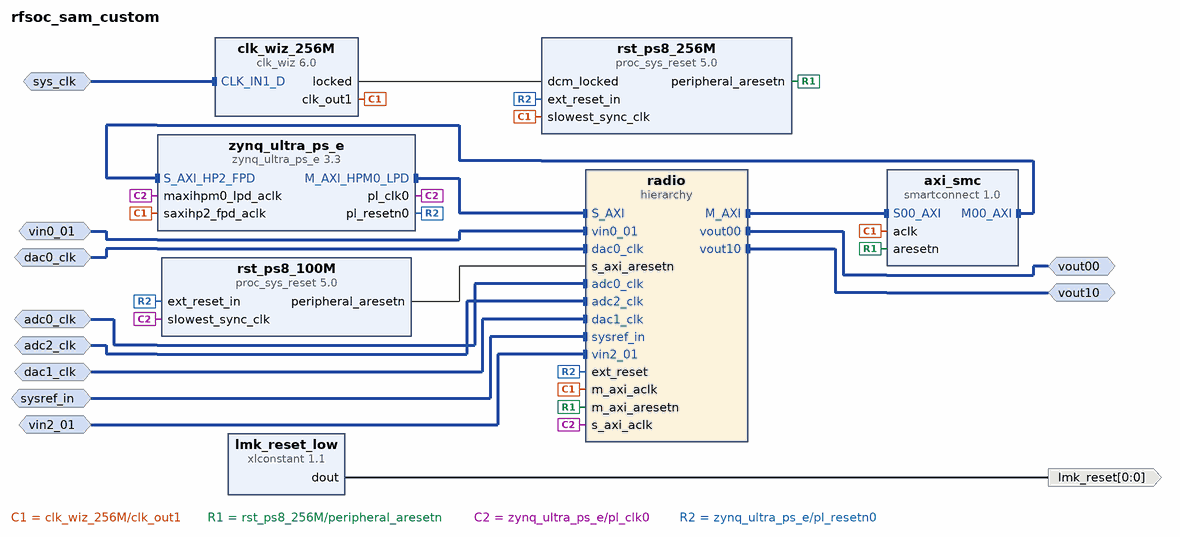
[diagram p0: block diagram of the top level]
# Vivado block design rfsoc_sam_custom, xczu28dr-ffvg1517-2-e, Vivado 2020.2
create_bd_design rfsoc_sam_custom

create_bd_intf_port -mode Slave -vlnv xilinx.com:interface:diff_clock_rtl:1.0 adc0_clk
set_property -dict {CONFIG.FREQ_HZ 409600000.0} [get_bd_intf_ports adc0_clk]
create_bd_intf_port -mode Slave -vlnv xilinx.com:interface:diff_clock_rtl:1.0 adc2_clk
set_property -dict {CONFIG.FREQ_HZ 409600000.0} [get_bd_intf_ports adc2_clk]
create_bd_intf_port -mode Slave -vlnv xilinx.com:interface:diff_clock_rtl:1.0 dac0_clk
set_property -dict {CONFIG.FREQ_HZ 256000000.0} [get_bd_intf_ports dac0_clk]
create_bd_intf_port -mode Slave -vlnv xilinx.com:interface:diff_clock_rtl:1.0 dac1_clk
set_property -dict {CONFIG.FREQ_HZ 409600000.0} [get_bd_intf_ports dac1_clk]
create_bd_intf_port -mode Slave -vlnv xilinx.com:interface:diff_clock_rtl:1.0 sys_clk
set_property -dict {CONFIG.FREQ_HZ 200000000} [get_bd_intf_ports sys_clk]
create_bd_intf_port -mode Slave -vlnv xilinx.com:display_usp_rf_data_converter:diff_pins_rtl:1.0 sysref_in
create_bd_intf_port -mode Slave -vlnv xilinx.com:interface:diff_analog_io_rtl:1.0 vin0_01
create_bd_intf_port -mode Slave -vlnv xilinx.com:interface:diff_analog_io_rtl:1.0 vin2_01
create_bd_intf_port -mode Master -vlnv xilinx.com:interface:diff_analog_io_rtl:1.0 vout00
create_bd_intf_port -mode Master -vlnv xilinx.com:interface:diff_analog_io_rtl:1.0 vout10
create_bd_port -dir O -from 0 -to 0 lmk_reset

create_bd_cell -type ip -vlnv xilinx.com:ip:smartconnect:1.0 axi_smc
set_property -dict {CONFIG.NUM_SI 1} [get_bd_cells axi_smc]
create_bd_cell -type ip -vlnv xilinx.com:ip:clk_wiz:6.0 clk_wiz_256M
set_property -dict [list \
  CONFIG.CLKIN1_JITTER_PS 50.0 \
  CONFIG.CLKOUT1_JITTER 133.468 \
  CONFIG.CLKOUT1_PHASE_ERROR 176.321 \
  CONFIG.CLKOUT1_REQUESTED_OUT_FREQ 256 \
  CONFIG.MMCM_CLKFBOUT_MULT_F 28.000 \
  CONFIG.MMCM_CLKIN1_PERIOD 5.000 \
  CONFIG.MMCM_CLKIN2_PERIOD 10.0 \
  CONFIG.MMCM_CLKOUT0_DIVIDE_F 4.375 \
  CONFIG.MMCM_DIVCLK_DIVIDE 5 \
  CONFIG.PRIM_IN_FREQ 200 \
  CONFIG.PRIM_SOURCE Differential_clock_capable_pin \
  CONFIG.RESET_PORT reset \
  CONFIG.RESET_TYPE ACTIVE_HIGH \
  CONFIG.USE_RESET false \
] [get_bd_cells clk_wiz_256M]
create_bd_cell -type ip -vlnv xilinx.com:ip:xlconstant:1.1 lmk_reset_low
set_property -dict {CONFIG.CONST_VAL 0} [get_bd_cells lmk_reset_low]
create_bd_cell -type hier radio
create_bd_cell -type ip -vlnv xilinx.com:ip:proc_sys_reset:5.0 rst_ps8_100M
create_bd_cell -type ip -vlnv xilinx.com:ip:proc_sys_reset:5.0 rst_ps8_256M
create_bd_cell -type ip -vlnv xilinx.com:ip:zynq_ultra_ps_e:3.3 zynq_ultra_ps_e
set_property -dict [list \
  CONFIG.CAN0_BOARD_INTERFACE custom \
  CONFIG.CAN1_BOARD_INTERFACE custom \
  CONFIG.CSU_BOARD_INTERFACE custom \
  CONFIG.DP_BOARD_INTERFACE custom \
  CONFIG.GEM0_BOARD_INTERFACE custom \
  CONFIG.GEM1_BOARD_INTERFACE custom \
  CONFIG.GEM2_BOARD_INTERFACE custom \
  CONFIG.GEM3_BOARD_INTERFACE custom \
  CONFIG.GPIO_BOARD_INTERFACE custom \
  CONFIG.IIC0_BOARD_INTERFACE custom \
  CONFIG.IIC1_BOARD_INTERFACE custom \
  CONFIG.NAND_BOARD_INTERFACE custom \
  CONFIG.PCIE_BOARD_INTERFACE custom \
  CONFIG.PJTAG_BOARD_INTERFACE custom \
  CONFIG.PMU_BOARD_INTERFACE custom \
  CONFIG.PSU_BANK_0_IO_STANDARD LVCMOS33 \
  CONFIG.PSU_BANK_1_IO_STANDARD LVCMOS33 \
  CONFIG.PSU_BANK_2_IO_STANDARD LVCMOS33 \
  CONFIG.PSU_BANK_3_IO_STANDARD LVCMOS33 \
  CONFIG.PSU_USB3__DUAL_CLOCK_ENABLE 0 \
  CONFIG.PSU__CAN1__PERIPHERAL__ENABLE 0 \
  CONFIG.PSU__CRF_APB__ACPU_CTRL__FREQMHZ 1333.333 \
  CONFIG.PSU__CRF_APB__ACPU_CTRL__SRCSEL APLL \
  CONFIG.PSU__CRF_APB__APLL_CTRL__SRCSEL PSS_REF_CLK \
  CONFIG.PSU__CRF_APB__DBG_FPD_CTRL__FREQMHZ 250 \
  CONFIG.PSU__CRF_APB__DBG_FPD_CTRL__SRCSEL IOPLL \
  CONFIG.PSU__CRF_APB__DBG_TRACE_CTRL__FREQMHZ 250 \
  CONFIG.PSU__CRF_APB__DBG_TRACE_CTRL__SRCSEL IOPLL \
  CONFIG.PSU__CRF_APB__DBG_TSTMP_CTRL__FREQMHZ 250 \
  CONFIG.PSU__CRF_APB__DBG_TSTMP_CTRL__SRCSEL IOPLL \
  CONFIG.PSU__CRF_APB__DDR_CTRL__FREQMHZ 800 \
  CONFIG.PSU__CRF_APB__DDR_CTRL__SRCSEL DPLL \
  CONFIG.PSU__CRF_APB__DPDMA_REF_CTRL__FREQMHZ 600 \
  CONFIG.PSU__CRF_APB__DPDMA_REF_CTRL__SRCSEL DPLL \
  CONFIG.PSU__CRF_APB__DPLL_CTRL__SRCSEL PSS_REF_CLK \
  CONFIG.PSU__CRF_APB__DP_AUDIO_REF_CTRL__SRCSEL VPLL \
  CONFIG.PSU__CRF_APB__DP_STC_REF_CTRL__SRCSEL VPLL \
  CONFIG.PSU__CRF_APB__DP_VIDEO_REF_CTRL__SRCSEL DPLL \
  CONFIG.PSU__CRF_APB__GDMA_REF_CTRL__FREQMHZ 600 \
  CONFIG.PSU__CRF_APB__GDMA_REF_CTRL__SRCSEL DPLL \
  CONFIG.PSU__CRF_APB__GPU_REF_CTRL__FREQMHZ 600 \
  CONFIG.PSU__CRF_APB__GPU_REF_CTRL__SRCSEL DPLL \
  CONFIG.PSU__CRF_APB__TOPSW_LSBUS_CTRL__FREQMHZ 100 \
  CONFIG.PSU__CRF_APB__TOPSW_LSBUS_CTRL__SRCSEL IOPLL \
  CONFIG.PSU__CRF_APB__TOPSW_MAIN_CTRL__FREQMHZ 533.333 \
  CONFIG.PSU__CRF_APB__TOPSW_MAIN_CTRL__SRCSEL VPLL \
  CONFIG.PSU__CRF_APB__VPLL_CTRL__SRCSEL PSS_REF_CLK \
  CONFIG.PSU__CRL_APB__ADMA_REF_CTRL__FREQMHZ 533.333 \
  CONFIG.PSU__CRL_APB__ADMA_REF_CTRL__SRCSEL RPLL \
  CONFIG.PSU__CRL_APB__CAN1_REF_CTRL__FREQMHZ 100 \
  CONFIG.PSU__CRL_APB__CAN1_REF_CTRL__SRCSEL IOPLL \
  CONFIG.PSU__CRL_APB__CPU_R5_CTRL__FREQMHZ 533.333 \
  CONFIG.PSU__CRL_APB__CPU_R5_CTRL__SRCSEL RPLL \
  CONFIG.PSU__CRL_APB__DBG_LPD_CTRL__FREQMHZ 250 \
  CONFIG.PSU__CRL_APB__DBG_LPD_CTRL__SRCSEL IOPLL \
  CONFIG.PSU__CRL_APB__GEM3_REF_CTRL__FREQMHZ 125 \
  CONFIG.PSU__CRL_APB__GEM3_REF_CTRL__SRCSEL IOPLL \
  CONFIG.PSU__CRL_APB__I2C0_REF_CTRL__FREQMHZ 100 \
  CONFIG.PSU__CRL_APB__I2C0_REF_CTRL__SRCSEL IOPLL \
  CONFIG.PSU__CRL_APB__I2C1_REF_CTRL__FREQMHZ 100 \
  CONFIG.PSU__CRL_APB__I2C1_REF_CTRL__SRCSEL IOPLL \
  CONFIG.PSU__CRL_APB__IOPLL_CTRL__SRCSEL PSS_REF_CLK \
  CONFIG.PSU__CRL_APB__IOU_SWITCH_CTRL__FREQMHZ 267 \
  CONFIG.PSU__CRL_APB__IOU_SWITCH_CTRL__SRCSEL RPLL \
  CONFIG.PSU__CRL_APB__LPD_LSBUS_CTRL__FREQMHZ 100 \
  CONFIG.PSU__CRL_APB__LPD_LSBUS_CTRL__SRCSEL IOPLL \
  CONFIG.PSU__CRL_APB__LPD_SWITCH_CTRL__FREQMHZ 533.333 \
  CONFIG.PSU__CRL_APB__LPD_SWITCH_CTRL__SRCSEL RPLL \
  CONFIG.PSU__CRL_APB__PCAP_CTRL__FREQMHZ 200 \
  CONFIG.PSU__CRL_APB__PCAP_CTRL__SRCSEL IOPLL \
  CONFIG.PSU__CRL_APB__PL0_REF_CTRL__FREQMHZ 100 \
  CONFIG.PSU__CRL_APB__PL0_REF_CTRL__SRCSEL IOPLL \
  CONFIG.PSU__CRL_APB__QSPI_REF_CTRL__FREQMHZ 300 \
  CONFIG.PSU__CRL_APB__QSPI_REF_CTRL__SRCSEL IOPLL \
  CONFIG.PSU__CRL_APB__RPLL_CTRL__SRCSEL PSS_REF_CLK \
  CONFIG.PSU__CRL_APB__SDIO1_REF_CTRL__FREQMHZ 200 \
  CONFIG.PSU__CRL_APB__SDIO1_REF_CTRL__SRCSEL RPLL \
  CONFIG.PSU__CRL_APB__TIMESTAMP_REF_CTRL__FREQMHZ 100 \
  CONFIG.PSU__CRL_APB__TIMESTAMP_REF_CTRL__SRCSEL PSS_REF_CLK \
  CONFIG.PSU__CRL_APB__UART0_REF_CTRL__FREQMHZ 100 \
  CONFIG.PSU__CRL_APB__UART0_REF_CTRL__SRCSEL IOPLL \
  CONFIG.PSU__CRL_APB__UART1_REF_CTRL__FREQMHZ 100 \
  CONFIG.PSU__CRL_APB__UART1_REF_CTRL__SRCSEL IOPLL \
  CONFIG.PSU__CRL_APB__USB0_BUS_REF_CTRL__FREQMHZ 250 \
  CONFIG.PSU__CRL_APB__USB0_BUS_REF_CTRL__SRCSEL IOPLL \
  CONFIG.PSU__CRL_APB__USB3_DUAL_REF_CTRL__FREQMHZ 20 \
  CONFIG.PSU__CRL_APB__USB3_DUAL_REF_CTRL__SRCSEL IOPLL \
  CONFIG.PSU__CRL_APB__USB3__ENABLE 0 \
  CONFIG.PSU__CSUPMU__PERIPHERAL__VALID 0 \
  CONFIG.PSU__DDRC__BUS_WIDTH {64 Bit} \
  CONFIG.PSU__DDRC__COMPONENTS Components \
  CONFIG.PSU__DDRC__DEVICE_CAPACITY {2048 MBits} \
  CONFIG.PSU__DDRC__DRAM_WIDTH {8 Bits} \
  CONFIG.PSU__DDRC__ECC Disabled \
  CONFIG.PSU__DDRC__MEMORY_TYPE {DDR 4} \
  CONFIG.PSU__DDRC__SPEED_BIN DDR4_1600J \
  CONFIG.PSU__DDR_HIGH_ADDRESS_GUI_ENABLE 0 \
  CONFIG.PSU__DDR__INTERFACE__FREQMHZ 400.000 \
  CONFIG.PSU__DEVICE_TYPE RFSOC \
  CONFIG.PSU__DISPLAYPORT__PERIPHERAL__ENABLE 0 \
  CONFIG.PSU__DLL__ISUSED 0 \
  CONFIG.PSU__ENET3__PERIPHERAL__ENABLE 0 \
  CONFIG.PSU__FPD_SLCR__WDT1__FREQMHZ 100 \
  CONFIG.PSU__FPGA_PL0_ENABLE 1 \
  CONFIG.PSU__GPIO0_MIO__PERIPHERAL__ENABLE 0 \
  CONFIG.PSU__GPIO1_MIO__PERIPHERAL__ENABLE 0 \
  CONFIG.PSU__GPU_PP0__POWER__ON 0 \
  CONFIG.PSU__GPU_PP1__POWER__ON 0 \
  CONFIG.PSU__I2C0__PERIPHERAL__ENABLE 0 \
  CONFIG.PSU__I2C1__PERIPHERAL__ENABLE 0 \
  CONFIG.PSU__IOU_SLCR__IOU_TTC_APB_CLK__TTC0_SEL APB \
  CONFIG.PSU__IOU_SLCR__IOU_TTC_APB_CLK__TTC1_SEL APB \
  CONFIG.PSU__IOU_SLCR__IOU_TTC_APB_CLK__TTC2_SEL APB \
  CONFIG.PSU__IOU_SLCR__IOU_TTC_APB_CLK__TTC3_SEL APB \
  CONFIG.PSU__IOU_SLCR__TTC0__FREQMHZ 100 \
  CONFIG.PSU__IOU_SLCR__TTC1__FREQMHZ 100 \
  CONFIG.PSU__IOU_SLCR__TTC2__FREQMHZ 100 \
  CONFIG.PSU__IOU_SLCR__TTC3__FREQMHZ 100 \
  CONFIG.PSU__IOU_SLCR__WDT0__FREQMHZ 100 \
  CONFIG.PSU__LPD_SLCR__CSUPMU__FREQMHZ 100 \
  CONFIG.PSU__OVERRIDE_HPX_QOS 0 \
  CONFIG.PSU__OVERRIDE__BASIC_CLOCK 0 \
  CONFIG.PSU__PMU__PERIPHERAL__ENABLE 0 \
  CONFIG.PSU__PRESET_APPLIED 0 \
  CONFIG.PSU__PSS_REF_CLK__FREQMHZ 33.333 \
  CONFIG.PSU__QSPI__PERIPHERAL__ENABLE 0 \
  CONFIG.PSU__SATA__PERIPHERAL__ENABLE 0 \
  CONFIG.PSU__SD1__PERIPHERAL__ENABLE 0 \
  CONFIG.PSU__SWDT0__PERIPHERAL__ENABLE 0 \
  CONFIG.PSU__SWDT1__PERIPHERAL__ENABLE 0 \
  CONFIG.PSU__TTC0__PERIPHERAL__ENABLE 0 \
  CONFIG.PSU__TTC1__PERIPHERAL__ENABLE 0 \
  CONFIG.PSU__TTC2__PERIPHERAL__ENABLE 0 \
  CONFIG.PSU__TTC3__PERIPHERAL__ENABLE 0 \
  CONFIG.PSU__UART0__PERIPHERAL__ENABLE 0 \
  CONFIG.PSU__UART1__PERIPHERAL__ENABLE 0 \
  CONFIG.PSU__USB0__PERIPHERAL__ENABLE 0 \
  CONFIG.PSU__USE__IRQ0 0 \
  CONFIG.PSU__USE__M_AXI_GP0 0 \
  CONFIG.PSU__USE__M_AXI_GP1 0 \
  CONFIG.PSU__USE__M_AXI_GP2 1 \
  CONFIG.PSU__USE__S_AXI_GP4 1 \
  CONFIG.QSPI_BOARD_INTERFACE custom \
  CONFIG.SATA_BOARD_INTERFACE custom \
  CONFIG.SD0_BOARD_INTERFACE custom \
  CONFIG.SD1_BOARD_INTERFACE custom \
  CONFIG.SPI0_BOARD_INTERFACE custom \
  CONFIG.SPI1_BOARD_INTERFACE custom \
  CONFIG.SUBPRESET1 Custom \
  CONFIG.SUBPRESET2 Custom \
  CONFIG.SWDT0_BOARD_INTERFACE custom \
  CONFIG.SWDT1_BOARD_INTERFACE custom \
  CONFIG.TRACE_BOARD_INTERFACE custom \
  CONFIG.TTC0_BOARD_INTERFACE custom \
  CONFIG.TTC1_BOARD_INTERFACE custom \
  CONFIG.TTC2_BOARD_INTERFACE custom \
  CONFIG.TTC3_BOARD_INTERFACE custom \
  CONFIG.UART0_BOARD_INTERFACE custom \
  CONFIG.UART1_BOARD_INTERFACE custom \
  CONFIG.USB0_BOARD_INTERFACE custom \
  CONFIG.USB1_BOARD_INTERFACE custom \
] [get_bd_cells zynq_ultra_ps_e]
# 747 more settings of zynq_ultra_ps_e are not shown: defaults, MIO pin electricals, DDR timing, and values the tool derives

# ---- hierarchy /radio ----
current_bd_instance /radio
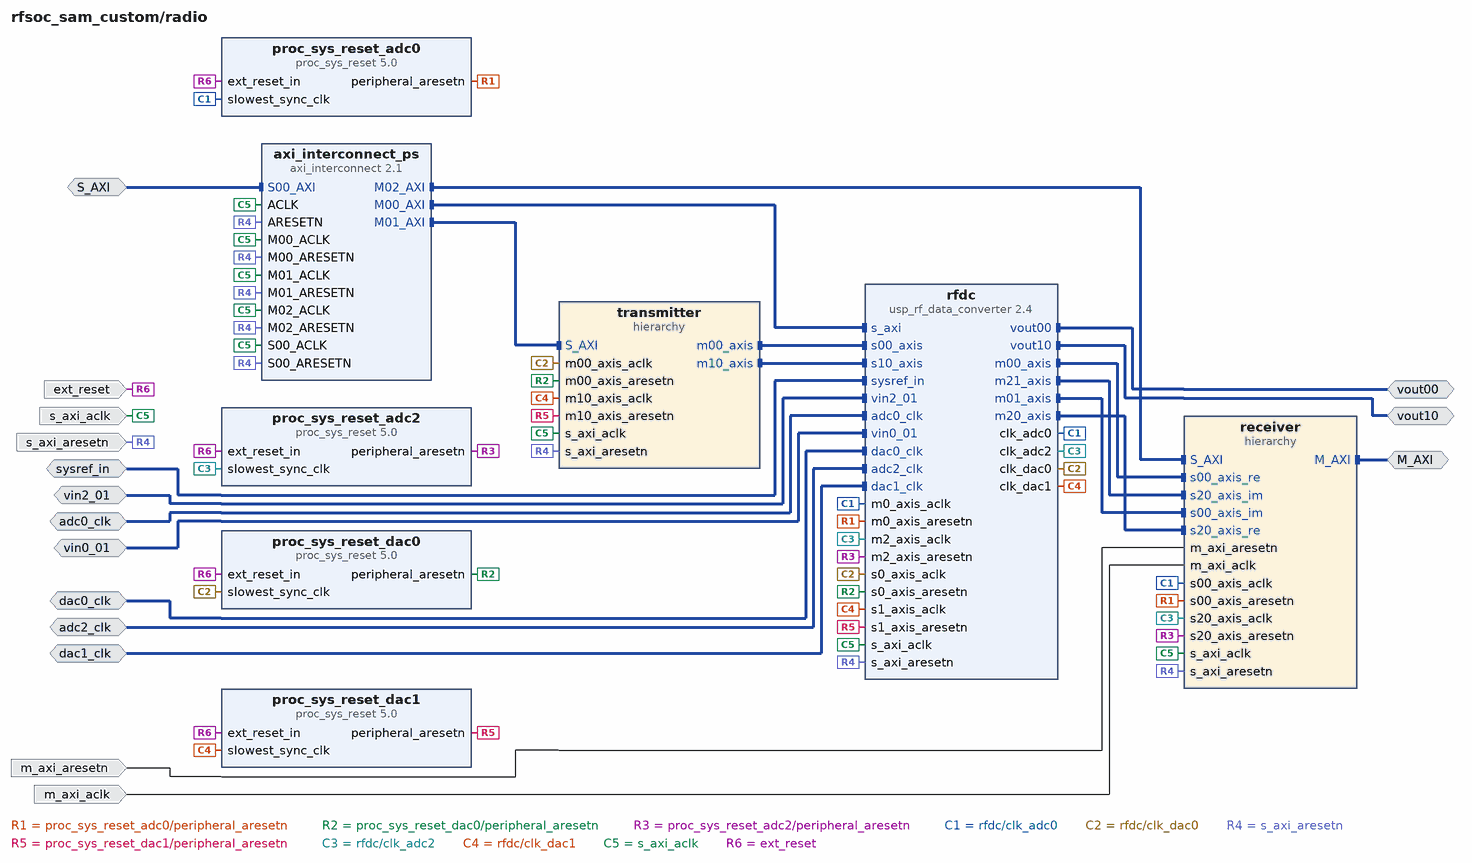
[diagram p1: block diagram inside /radio]
create_bd_intf_pin -mode Master -vlnv xilinx.com:interface:aximm_rtl:1.0 M_AXI
create_bd_intf_pin -mode Slave -vlnv xilinx.com:interface:aximm_rtl:1.0 S_AXI
create_bd_intf_pin -mode Slave -vlnv xilinx.com:interface:diff_clock_rtl:1.0 adc0_clk
create_bd_intf_pin -mode Slave -vlnv xilinx.com:interface:diff_clock_rtl:1.0 adc2_clk
create_bd_intf_pin -mode Slave -vlnv xilinx.com:interface:diff_clock_rtl:1.0 dac0_clk
create_bd_intf_pin -mode Slave -vlnv xilinx.com:interface:diff_clock_rtl:1.0 dac1_clk
create_bd_intf_pin -mode Slave -vlnv xilinx.com:display_usp_rf_data_converter:diff_pins_rtl:1.0 sysref_in
create_bd_intf_pin -mode Slave -vlnv xilinx.com:interface:diff_analog_io_rtl:1.0 vin0_01
create_bd_intf_pin -mode Slave -vlnv xilinx.com:interface:diff_analog_io_rtl:1.0 vin2_01
create_bd_intf_pin -mode Master -vlnv xilinx.com:interface:diff_analog_io_rtl:1.0 vout00
create_bd_intf_pin -mode Master -vlnv xilinx.com:interface:diff_analog_io_rtl:1.0 vout10
create_bd_pin -dir I -type rst ext_reset
create_bd_pin -dir I -type clk m_axi_aclk
create_bd_pin -dir I -type rst m_axi_aresetn
create_bd_pin -dir I -type clk s_axi_aclk
create_bd_pin -dir I -type rst s_axi_aresetn

create_bd_cell -type ip -vlnv xilinx.com:ip:axi_interconnect:2.1 axi_interconnect_ps
set_property -dict {CONFIG.NUM_MI 3} [get_bd_cells axi_interconnect_ps]
create_bd_cell -type ip -vlnv xilinx.com:ip:proc_sys_reset:5.0 proc_sys_reset_adc0
create_bd_cell -type ip -vlnv xilinx.com:ip:proc_sys_reset:5.0 proc_sys_reset_adc2
create_bd_cell -type ip -vlnv xilinx.com:ip:proc_sys_reset:5.0 proc_sys_reset_dac0
create_bd_cell -type ip -vlnv xilinx.com:ip:proc_sys_reset:5.0 proc_sys_reset_dac1
create_bd_cell -type hier receiver
create_bd_cell -type ip -vlnv xilinx.com:ip:usp_rf_data_converter:2.4 rfdc
set_property -dict [list \
  CONFIG.ADC0_Outclk_Freq 256.000 \
  CONFIG.ADC0_PLL_Enable true \
  CONFIG.ADC0_Refclk_Freq 409.600 \
  CONFIG.ADC0_Sampling_Rate 4.096 \
  CONFIG.ADC2_Outclk_Freq 256.000 \
  CONFIG.ADC2_PLL_Enable true \
  CONFIG.ADC2_Refclk_Freq 409.600 \
  CONFIG.ADC2_Sampling_Rate 4.096 \
  CONFIG.ADC_Data_Type00 1 \
  CONFIG.ADC_Data_Type20 1 \
  CONFIG.ADC_Data_Width00 8 \
  CONFIG.ADC_Decimation_Mode00 2 \
  CONFIG.ADC_Decimation_Mode20 2 \
  CONFIG.ADC_Mixer_Mode00 0 \
  CONFIG.ADC_Mixer_Mode20 0 \
  CONFIG.ADC_Mixer_Type00 2 \
  CONFIG.ADC_Mixer_Type01 2 \
  CONFIG.ADC_Mixer_Type20 2 \
  CONFIG.ADC_Mixer_Type21 2 \
  CONFIG.ADC_Slice00_Enable true \
  CONFIG.ADC_Slice20_Enable true \
  CONFIG.DAC0_Outclk_Freq 256.000 \
  CONFIG.DAC0_PLL_Enable true \
  CONFIG.DAC0_Refclk_Freq 256.000 \
  CONFIG.DAC0_Sampling_Rate 4.096 \
  CONFIG.DAC1_Outclk_Freq 256.000 \
  CONFIG.DAC1_PLL_Enable true \
  CONFIG.DAC1_Refclk_Freq 409.600 \
  CONFIG.DAC1_Sampling_Rate 4.096 \
  CONFIG.DAC_Data_Type10 0 \
  CONFIG.DAC_Data_Width10 16 \
  CONFIG.DAC_Interpolation_Mode00 2 \
  CONFIG.DAC_Interpolation_Mode10 2 \
  CONFIG.DAC_Mixer_Mode00 0 \
  CONFIG.DAC_Mixer_Mode10 0 \
  CONFIG.DAC_Mixer_Type00 2 \
  CONFIG.DAC_Mixer_Type10 2 \
  CONFIG.DAC_Slice00_Enable true \
  CONFIG.DAC_Slice10_Enable true \
] [get_bd_cells rfdc]
create_bd_cell -type hier transmitter

# ---- hierarchy /radio/receiver ----
current_bd_instance /radio/receiver
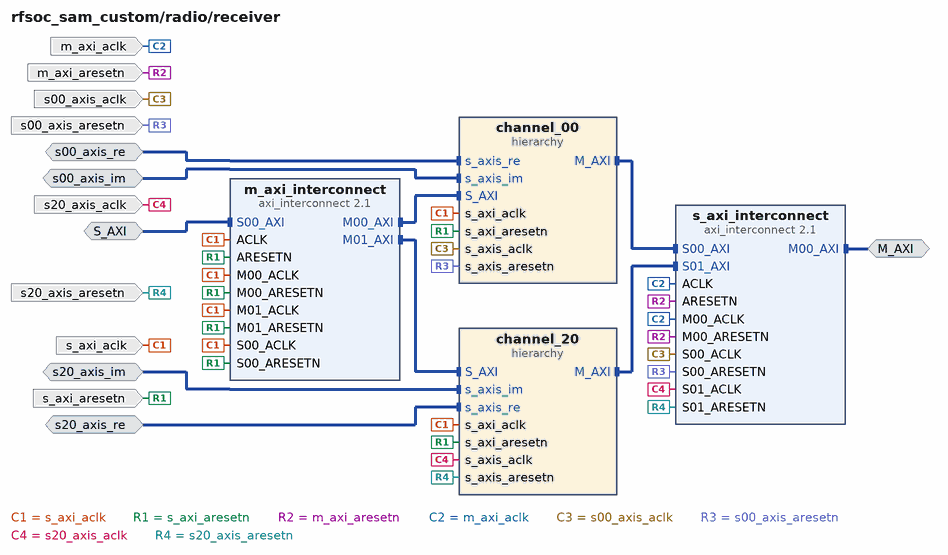
[diagram p2: block diagram inside /radio/receiver]
create_bd_intf_pin -mode Master -vlnv xilinx.com:interface:aximm_rtl:1.0 M_AXI
create_bd_intf_pin -mode Slave -vlnv xilinx.com:interface:aximm_rtl:1.0 S_AXI
create_bd_intf_pin -mode Slave -vlnv xilinx.com:interface:axis_rtl:1.0 s00_axis_im
create_bd_intf_pin -mode Slave -vlnv xilinx.com:interface:axis_rtl:1.0 s00_axis_re
create_bd_intf_pin -mode Slave -vlnv xilinx.com:interface:axis_rtl:1.0 s20_axis_im
create_bd_intf_pin -mode Slave -vlnv xilinx.com:interface:axis_rtl:1.0 s20_axis_re
create_bd_pin -dir I -type clk m_axi_aclk
create_bd_pin -dir I -type rst m_axi_aresetn
create_bd_pin -dir I -type clk s00_axis_aclk
create_bd_pin -dir I -type rst s00_axis_aresetn
create_bd_pin -dir I -type clk s20_axis_aclk
create_bd_pin -dir I -type rst s20_axis_aresetn
create_bd_pin -dir I -type clk s_axi_aclk
create_bd_pin -dir I -type rst s_axi_aresetn

create_bd_cell -type hier channel_00
create_bd_cell -type hier channel_20
create_bd_cell -type ip -vlnv xilinx.com:ip:axi_interconnect:2.1 m_axi_interconnect
create_bd_cell -type ip -vlnv xilinx.com:ip:axi_interconnect:2.1 s_axi_interconnect
set_property -dict [list \
  CONFIG.M00_HAS_DATA_FIFO 2 \
  CONFIG.NUM_MI 1 \
  CONFIG.NUM_SI 2 \
  CONFIG.S00_HAS_DATA_FIFO 2 \
  CONFIG.S01_HAS_DATA_FIFO 2 \
  CONFIG.STRATEGY 2 \
] [get_bd_cells s_axi_interconnect]

# ---- hierarchy /radio/receiver/channel_00 ----
current_bd_instance /radio/receiver/channel_00
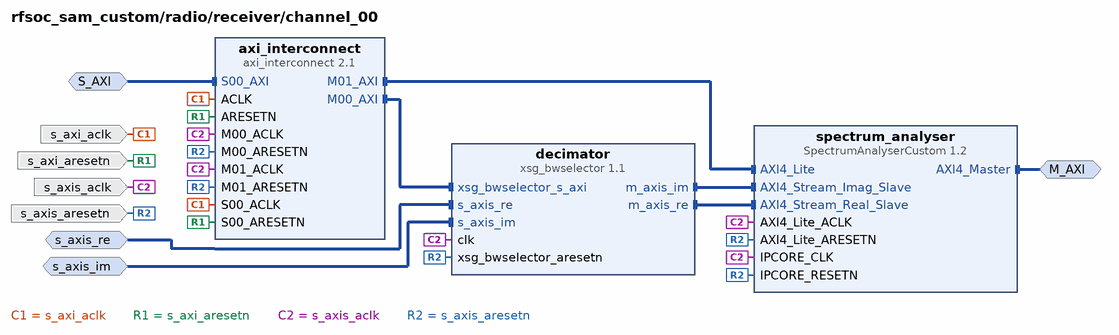
[diagram p3: block diagram inside /radio/receiver/channel_00]
create_bd_intf_pin -mode Master -vlnv xilinx.com:interface:aximm_rtl:1.0 M_AXI
create_bd_intf_pin -mode Slave -vlnv xilinx.com:interface:aximm_rtl:1.0 S_AXI
create_bd_intf_pin -mode Slave -vlnv xilinx.com:interface:axis_rtl:1.0 s_axis_im
create_bd_intf_pin -mode Slave -vlnv xilinx.com:interface:axis_rtl:1.0 s_axis_re
create_bd_pin -dir I -type clk s_axi_aclk
create_bd_pin -dir I -type rst s_axi_aresetn
create_bd_pin -dir I -type clk s_axis_aclk
create_bd_pin -dir I -type rst s_axis_aresetn

create_bd_cell -type ip -vlnv xilinx.com:ip:axi_interconnect:2.1 axi_interconnect
set_property -dict {CONFIG.NUM_MI 2} [get_bd_cells axi_interconnect]
create_bd_cell -type ip -vlnv strath.ac.uk:RFSoC:xsg_bwselector:1.1 decimator
create_bd_cell -type ip -vlnv xilinx.com:ip:SpectrumAnalyserCustom:1.2 spectrum_analyser

# ---- hierarchy /radio/receiver/channel_20 ----
current_bd_instance /radio/receiver/channel_20
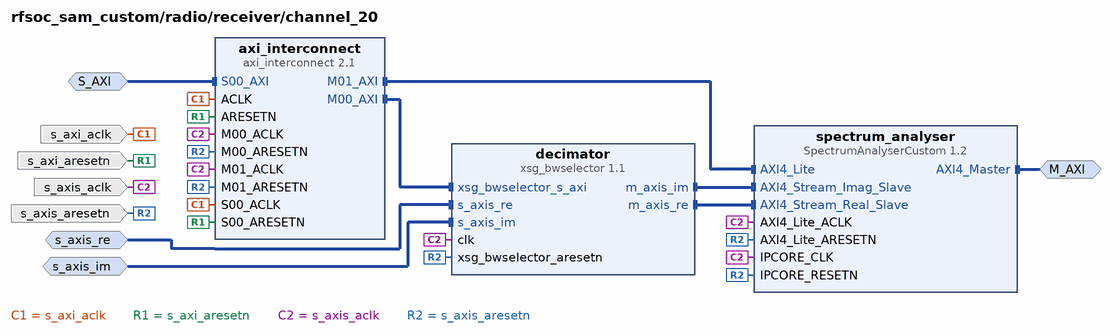
[diagram p4: block diagram inside /radio/receiver/channel_20]
create_bd_intf_pin -mode Master -vlnv xilinx.com:interface:aximm_rtl:1.0 M_AXI
create_bd_intf_pin -mode Slave -vlnv xilinx.com:interface:aximm_rtl:1.0 S_AXI
create_bd_intf_pin -mode Slave -vlnv xilinx.com:interface:axis_rtl:1.0 s_axis_im
create_bd_intf_pin -mode Slave -vlnv xilinx.com:interface:axis_rtl:1.0 s_axis_re
create_bd_pin -dir I -type clk s_axi_aclk
create_bd_pin -dir I -type rst s_axi_aresetn
create_bd_pin -dir I -type clk s_axis_aclk
create_bd_pin -dir I -type rst s_axis_aresetn

create_bd_cell -type ip -vlnv xilinx.com:ip:axi_interconnect:2.1 axi_interconnect
set_property -dict {CONFIG.NUM_MI 2} [get_bd_cells axi_interconnect]
create_bd_cell -type ip -vlnv strath.ac.uk:RFSoC:xsg_bwselector:1.1 decimator
create_bd_cell -type ip -vlnv xilinx.com:ip:SpectrumAnalyserCustom:1.2 spectrum_analyser

# ---- hierarchy /radio/transmitter ----
current_bd_instance /radio/transmitter
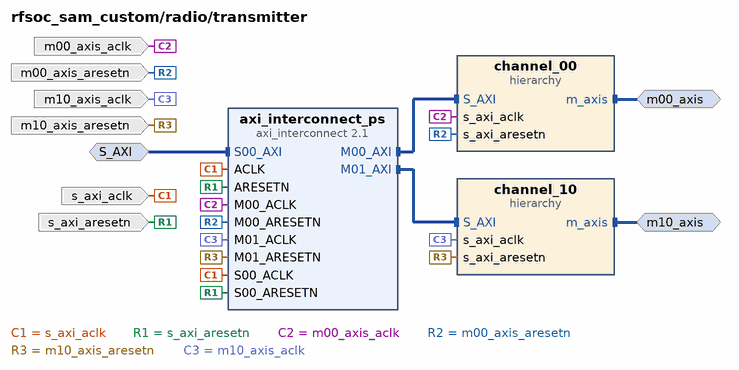
[diagram p5: block diagram inside /radio/transmitter]
create_bd_intf_pin -mode Slave -vlnv xilinx.com:interface:aximm_rtl:1.0 S_AXI
create_bd_intf_pin -mode Master -vlnv xilinx.com:interface:axis_rtl:1.0 m00_axis
create_bd_intf_pin -mode Master -vlnv xilinx.com:interface:axis_rtl:1.0 m10_axis
create_bd_pin -dir I -type clk m00_axis_aclk
create_bd_pin -dir I -type rst m00_axis_aresetn
create_bd_pin -dir I -type clk m10_axis_aclk
create_bd_pin -dir I -type rst m10_axis_aresetn
create_bd_pin -dir I -type clk s_axi_aclk
create_bd_pin -dir I -type rst s_axi_aresetn

create_bd_cell -type ip -vlnv xilinx.com:ip:axi_interconnect:2.1 axi_interconnect_ps
create_bd_cell -type hier channel_00
create_bd_cell -type hier channel_10

# ---- hierarchy /radio/transmitter/channel_00 ----
current_bd_instance /radio/transmitter/channel_00
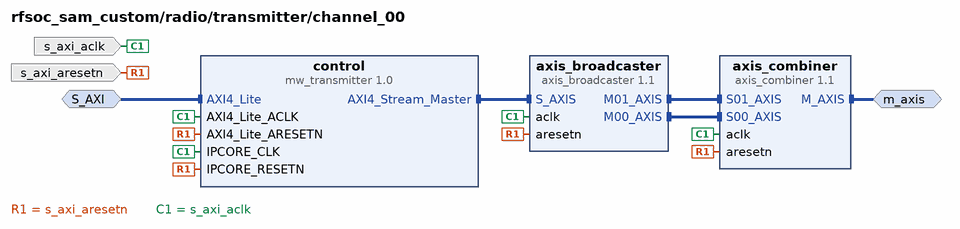
[diagram p6: block diagram inside /radio/transmitter/channel_00]
create_bd_intf_pin -mode Slave -vlnv xilinx.com:interface:aximm_rtl:1.0 S_AXI
create_bd_intf_pin -mode Master -vlnv xilinx.com:interface:axis_rtl:1.0 m_axis
create_bd_pin -dir I -type clk s_axi_aclk
create_bd_pin -dir I -type rst s_axi_aresetn

create_bd_cell -type ip -vlnv xilinx.com:ip:axis_broadcaster:1.1 axis_broadcaster
set_property -dict {CONFIG.M00_TDATA_REMAP {tdata[127:0]} CONFIG.M01_TDATA_REMAP {tdata[127:0]}} [get_bd_cells axis_broadcaster]
create_bd_cell -type ip -vlnv xilinx.com:ip:axis_combiner:1.1 axis_combiner
create_bd_cell -type ip -vlnv xilinx.com:ip:mw_transmitter:1.0 control

# ---- hierarchy /radio/transmitter/channel_10 ----
current_bd_instance /radio/transmitter/channel_10
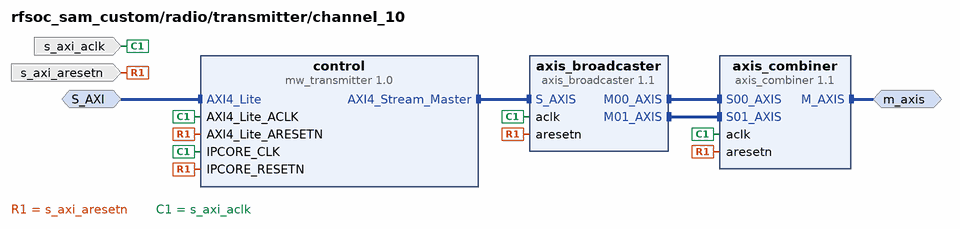
[diagram p7: block diagram inside /radio/transmitter/channel_10]
create_bd_intf_pin -mode Slave -vlnv xilinx.com:interface:aximm_rtl:1.0 S_AXI
create_bd_intf_pin -mode Master -vlnv xilinx.com:interface:axis_rtl:1.0 m_axis
create_bd_pin -dir I -type clk s_axi_aclk
create_bd_pin -dir I -type rst s_axi_aresetn

create_bd_cell -type ip -vlnv xilinx.com:ip:axis_broadcaster:1.1 axis_broadcaster
set_property -dict {CONFIG.M00_TDATA_REMAP {tdata[127:0]} CONFIG.M01_TDATA_REMAP {tdata[127:0]}} [get_bd_cells axis_broadcaster]
create_bd_cell -type ip -vlnv xilinx.com:ip:axis_combiner:1.1 axis_combiner
create_bd_cell -type ip -vlnv xilinx.com:ip:mw_transmitter:1.0 control

# ---- connections ----

current_bd_instance /radio
connect_bd_intf_net [get_bd_intf_pins receiver/s00_axis_re] [get_bd_intf_pins rfdc/m00_axis]
connect_bd_intf_net [get_bd_intf_pins sysref_in] [get_bd_intf_pins rfdc/sysref_in]
connect_bd_intf_net [get_bd_intf_pins S_AXI] [get_bd_intf_pins axi_interconnect_ps/S00_AXI]
connect_bd_intf_net [get_bd_intf_pins vout10] [get_bd_intf_pins rfdc/vout10]
connect_bd_intf_net [get_bd_intf_pins receiver/s20_axis_im] [get_bd_intf_pins rfdc/m21_axis]
connect_bd_intf_net [get_bd_intf_pins axi_interconnect_ps/M00_AXI] [get_bd_intf_pins rfdc/s_axi]
connect_bd_intf_net [get_bd_intf_pins rfdc/s00_axis] [get_bd_intf_pins transmitter/m00_axis]
connect_bd_intf_net [get_bd_intf_pins vin2_01] [get_bd_intf_pins rfdc/vin2_01]
connect_bd_intf_net [get_bd_intf_pins receiver/s00_axis_im] [get_bd_intf_pins rfdc/m01_axis]
connect_bd_intf_net [get_bd_intf_pins receiver/s20_axis_re] [get_bd_intf_pins rfdc/m20_axis]
connect_bd_intf_net [get_bd_intf_pins axi_interconnect_ps/M01_AXI] [get_bd_intf_pins transmitter/S_AXI]
connect_bd_intf_net [get_bd_intf_pins M_AXI] [get_bd_intf_pins receiver/M_AXI]
connect_bd_intf_net [get_bd_intf_pins adc0_clk] [get_bd_intf_pins rfdc/adc0_clk]
connect_bd_intf_net [get_bd_intf_pins vin0_01] [get_bd_intf_pins rfdc/vin0_01]
connect_bd_intf_net [get_bd_intf_pins dac0_clk] [get_bd_intf_pins rfdc/dac0_clk]
connect_bd_intf_net [get_bd_intf_pins vout00] [get_bd_intf_pins rfdc/vout00]
connect_bd_intf_net [get_bd_intf_pins adc2_clk] [get_bd_intf_pins rfdc/adc2_clk]
connect_bd_intf_net [get_bd_intf_pins rfdc/s10_axis] [get_bd_intf_pins transmitter/m10_axis]
connect_bd_intf_net [get_bd_intf_pins dac1_clk] [get_bd_intf_pins rfdc/dac1_clk]
connect_bd_intf_net [get_bd_intf_pins axi_interconnect_ps/M02_AXI] [get_bd_intf_pins receiver/S_AXI]
connect_bd_net -net IPCORE_RESETN_0_1 [get_bd_pins m_axi_aresetn] [get_bd_pins receiver/m_axi_aresetn]
connect_bd_net -net m_axis_aclk_0_1 [get_bd_pins m_axi_aclk] [get_bd_pins receiver/m_axi_aclk]
connect_bd_net -net proc_sys_reset_adc3_peripheral_aresetn [get_bd_pins proc_sys_reset_adc0/peripheral_aresetn] \
  [get_bd_pins receiver/s00_axis_aresetn] [get_bd_pins rfdc/m0_axis_aresetn]
connect_bd_net [get_bd_pins proc_sys_reset_dac0/peripheral_aresetn] [get_bd_pins rfdc/s0_axis_aresetn] [get_bd_pins transmitter/m00_axis_aresetn]
connect_bd_net -net proc_sys_reset_peripheral_aresetn [get_bd_pins proc_sys_reset_adc2/peripheral_aresetn] \
  [get_bd_pins receiver/s20_axis_aresetn] [get_bd_pins rfdc/m2_axis_aresetn]
connect_bd_net [get_bd_pins rfdc/clk_adc0] \
  [get_bd_pins proc_sys_reset_adc0/slowest_sync_clk] [get_bd_pins receiver/s00_axis_aclk] [get_bd_pins rfdc/m0_axis_aclk]
connect_bd_net [get_bd_pins rfdc/clk_dac0] \
  [get_bd_pins proc_sys_reset_dac0/slowest_sync_clk] [get_bd_pins rfdc/s0_axis_aclk] [get_bd_pins transmitter/m00_axis_aclk]
connect_bd_net -net rst_ps8_96M_peripheral_aresetn [get_bd_pins s_axi_aresetn] \
  [get_bd_pins axi_interconnect_ps/ARESETN] [get_bd_pins axi_interconnect_ps/M00_ARESETN] \
  [get_bd_pins axi_interconnect_ps/M01_ARESETN] [get_bd_pins axi_interconnect_ps/M02_ARESETN] \
  [get_bd_pins axi_interconnect_ps/S00_ARESETN] [get_bd_pins receiver/s_axi_aresetn] [get_bd_pins rfdc/s_axi_aresetn] \
  [get_bd_pins transmitter/s_axi_aresetn]
connect_bd_net -net rst_usp_rf_data_converter_256M_peripheral_aresetn [get_bd_pins proc_sys_reset_dac1/peripheral_aresetn] \
  [get_bd_pins rfdc/s1_axis_aresetn] [get_bd_pins transmitter/m10_axis_aresetn]
connect_bd_net -net usp_rf_data_converter_clk_adc2 [get_bd_pins rfdc/clk_adc2] \
  [get_bd_pins proc_sys_reset_adc2/slowest_sync_clk] [get_bd_pins receiver/s20_axis_aclk] [get_bd_pins rfdc/m2_axis_aclk]
connect_bd_net -net usp_rf_data_converter_clk_dac1 [get_bd_pins rfdc/clk_dac1] \
  [get_bd_pins proc_sys_reset_dac1/slowest_sync_clk] [get_bd_pins rfdc/s1_axis_aclk] [get_bd_pins transmitter/m10_axis_aclk]
connect_bd_net -net zynq_ultra_ps_e_pl_clk0 [get_bd_pins s_axi_aclk] \
  [get_bd_pins axi_interconnect_ps/ACLK] [get_bd_pins axi_interconnect_ps/M00_ACLK] \
  [get_bd_pins axi_interconnect_ps/M01_ACLK] [get_bd_pins axi_interconnect_ps/M02_ACLK] \
  [get_bd_pins axi_interconnect_ps/S00_ACLK] [get_bd_pins receiver/s_axi_aclk] [get_bd_pins rfdc/s_axi_aclk] \
  [get_bd_pins transmitter/s_axi_aclk]
connect_bd_net -net zynq_ultra_ps_e_pl_resetn0 [get_bd_pins ext_reset] \
  [get_bd_pins proc_sys_reset_adc0/ext_reset_in] [get_bd_pins proc_sys_reset_adc2/ext_reset_in] \
  [get_bd_pins proc_sys_reset_dac0/ext_reset_in] [get_bd_pins proc_sys_reset_dac1/ext_reset_in]

current_bd_instance /radio/receiver
connect_bd_intf_net [get_bd_intf_pins s20_axis_im] [get_bd_intf_pins channel_20/s_axis_im]
connect_bd_intf_net [get_bd_intf_pins channel_20/M_AXI] [get_bd_intf_pins s_axi_interconnect/S01_AXI]
connect_bd_intf_net [get_bd_intf_pins s00_axis_re] [get_bd_intf_pins channel_00/s_axis_re]
connect_bd_intf_net [get_bd_intf_pins s20_axis_re] [get_bd_intf_pins channel_20/s_axis_re]
connect_bd_intf_net [get_bd_intf_pins s00_axis_im] [get_bd_intf_pins channel_00/s_axis_im]
connect_bd_intf_net [get_bd_intf_pins channel_00/M_AXI] [get_bd_intf_pins s_axi_interconnect/S00_AXI]
connect_bd_intf_net [get_bd_intf_pins channel_00/S_AXI] [get_bd_intf_pins m_axi_interconnect/M00_AXI]
connect_bd_intf_net [get_bd_intf_pins channel_20/S_AXI] [get_bd_intf_pins m_axi_interconnect/M01_AXI]
connect_bd_intf_net [get_bd_intf_pins M_AXI] [get_bd_intf_pins s_axi_interconnect/M00_AXI]
connect_bd_intf_net [get_bd_intf_pins S_AXI] [get_bd_intf_pins m_axi_interconnect/S00_AXI]
connect_bd_net -net ACLK_1 [get_bd_pins s_axi_aclk] \
  [get_bd_pins channel_00/s_axi_aclk] [get_bd_pins channel_20/s_axi_aclk] [get_bd_pins m_axi_interconnect/ACLK] \
  [get_bd_pins m_axi_interconnect/M00_ACLK] [get_bd_pins m_axi_interconnect/M01_ACLK] \
  [get_bd_pins m_axi_interconnect/S00_ACLK]
connect_bd_net -net ARESETN_1 [get_bd_pins s_axi_aresetn] \
  [get_bd_pins channel_00/s_axi_aresetn] [get_bd_pins channel_20/s_axi_aresetn] [get_bd_pins m_axi_interconnect/ARESETN] \
  [get_bd_pins m_axi_interconnect/M00_ARESETN] [get_bd_pins m_axi_interconnect/M01_ARESETN] \
  [get_bd_pins m_axi_interconnect/S00_ARESETN]
connect_bd_net -net IPCORE_RESETN_0_1 [get_bd_pins m_axi_aresetn] \
  [get_bd_pins s_axi_interconnect/ARESETN] [get_bd_pins s_axi_interconnect/M00_ARESETN]
connect_bd_net -net m_axis_aclk_0_1 [get_bd_pins m_axi_aclk] [get_bd_pins s_axi_interconnect/ACLK] [get_bd_pins s_axi_interconnect/M00_ACLK]
connect_bd_net [get_bd_pins s00_axis_aclk] [get_bd_pins channel_00/s_axis_aclk] [get_bd_pins s_axi_interconnect/S00_ACLK]
connect_bd_net [get_bd_pins s00_axis_aresetn] [get_bd_pins channel_00/s_axis_aresetn] [get_bd_pins s_axi_interconnect/S00_ARESETN]
connect_bd_net [get_bd_pins s20_axis_aclk] [get_bd_pins channel_20/s_axis_aclk] [get_bd_pins s_axi_interconnect/S01_ACLK]
connect_bd_net [get_bd_pins s20_axis_aresetn] [get_bd_pins channel_20/s_axis_aresetn] [get_bd_pins s_axi_interconnect/S01_ARESETN]

current_bd_instance /radio/receiver/channel_00
connect_bd_intf_net [get_bd_intf_pins S_AXI] [get_bd_intf_pins axi_interconnect/S00_AXI]
connect_bd_intf_net [get_bd_intf_pins M_AXI] [get_bd_intf_pins spectrum_analyser/AXI4_Master]
connect_bd_intf_net [get_bd_intf_pins axi_interconnect/M01_AXI] [get_bd_intf_pins spectrum_analyser/AXI4_Lite]
connect_bd_intf_net [get_bd_intf_pins decimator/m_axis_im] [get_bd_intf_pins spectrum_analyser/AXI4_Stream_Imag_Slave]
connect_bd_intf_net [get_bd_intf_pins axi_interconnect/M00_AXI] [get_bd_intf_pins decimator/xsg_bwselector_s_axi]
connect_bd_intf_net [get_bd_intf_pins decimator/m_axis_re] [get_bd_intf_pins spectrum_analyser/AXI4_Stream_Real_Slave]
connect_bd_intf_net [get_bd_intf_pins s_axis_re] [get_bd_intf_pins decimator/s_axis_re]
connect_bd_intf_net [get_bd_intf_pins s_axis_im] [get_bd_intf_pins decimator/s_axis_im]
connect_bd_net -net ACLK_1 [get_bd_pins s_axi_aclk] [get_bd_pins axi_interconnect/ACLK] [get_bd_pins axi_interconnect/S00_ACLK]
connect_bd_net -net ARESETN_1 [get_bd_pins s_axi_aresetn] [get_bd_pins axi_interconnect/ARESETN] [get_bd_pins axi_interconnect/S00_ARESETN]
connect_bd_net -net m_axi_aclk_1 [get_bd_pins s_axis_aclk] \
  [get_bd_pins axi_interconnect/M00_ACLK] [get_bd_pins axi_interconnect/M01_ACLK] [get_bd_pins decimator/clk] \
  [get_bd_pins spectrum_analyser/AXI4_Lite_ACLK] [get_bd_pins spectrum_analyser/IPCORE_CLK]
connect_bd_net -net m_axi_aresetn_1 [get_bd_pins s_axis_aresetn] \
  [get_bd_pins axi_interconnect/M00_ARESETN] [get_bd_pins axi_interconnect/M01_ARESETN] \
  [get_bd_pins decimator/xsg_bwselector_aresetn] [get_bd_pins spectrum_analyser/AXI4_Lite_ARESETN] \
  [get_bd_pins spectrum_analyser/IPCORE_RESETN]

current_bd_instance /radio/receiver/channel_20
connect_bd_intf_net [get_bd_intf_pins M_AXI] [get_bd_intf_pins spectrum_analyser/AXI4_Master]
connect_bd_intf_net [get_bd_intf_pins s_axis_re] [get_bd_intf_pins decimator/s_axis_re]
connect_bd_intf_net [get_bd_intf_pins axi_interconnect/M01_AXI] [get_bd_intf_pins spectrum_analyser/AXI4_Lite]
connect_bd_intf_net [get_bd_intf_pins decimator/m_axis_im] [get_bd_intf_pins spectrum_analyser/AXI4_Stream_Imag_Slave]
connect_bd_intf_net [get_bd_intf_pins decimator/m_axis_re] [get_bd_intf_pins spectrum_analyser/AXI4_Stream_Real_Slave]
connect_bd_intf_net [get_bd_intf_pins axi_interconnect/M00_AXI] [get_bd_intf_pins decimator/xsg_bwselector_s_axi]
connect_bd_intf_net [get_bd_intf_pins s_axis_im] [get_bd_intf_pins decimator/s_axis_im]
connect_bd_intf_net [get_bd_intf_pins S_AXI] [get_bd_intf_pins axi_interconnect/S00_AXI]
connect_bd_net -net ACLK_1 [get_bd_pins s_axi_aclk] [get_bd_pins axi_interconnect/ACLK] [get_bd_pins axi_interconnect/S00_ACLK]
connect_bd_net -net ARESETN_1 [get_bd_pins s_axi_aresetn] [get_bd_pins axi_interconnect/ARESETN] [get_bd_pins axi_interconnect/S00_ARESETN]
connect_bd_net -net m_axi_aclk_1 [get_bd_pins s_axis_aclk] \
  [get_bd_pins axi_interconnect/M00_ACLK] [get_bd_pins axi_interconnect/M01_ACLK] [get_bd_pins decimator/clk] \
  [get_bd_pins spectrum_analyser/AXI4_Lite_ACLK] [get_bd_pins spectrum_analyser/IPCORE_CLK]
connect_bd_net -net m_axi_aresetn_1 [get_bd_pins s_axis_aresetn] \
  [get_bd_pins axi_interconnect/M00_ARESETN] [get_bd_pins axi_interconnect/M01_ARESETN] \
  [get_bd_pins decimator/xsg_bwselector_aresetn] [get_bd_pins spectrum_analyser/AXI4_Lite_ARESETN] \
  [get_bd_pins spectrum_analyser/IPCORE_RESETN]

current_bd_instance /radio/transmitter
connect_bd_intf_net [get_bd_intf_pins S_AXI] [get_bd_intf_pins axi_interconnect_ps/S00_AXI]
connect_bd_intf_net [get_bd_intf_pins m00_axis] [get_bd_intf_pins channel_00/m_axis]
connect_bd_intf_net [get_bd_intf_pins axi_interconnect_ps/M01_AXI] [get_bd_intf_pins channel_10/S_AXI]
connect_bd_intf_net [get_bd_intf_pins m10_axis] [get_bd_intf_pins channel_10/m_axis]
connect_bd_intf_net [get_bd_intf_pins axi_interconnect_ps/M00_AXI] [get_bd_intf_pins channel_00/S_AXI]
connect_bd_net -net ACLK_1 [get_bd_pins s_axi_aclk] [get_bd_pins axi_interconnect_ps/ACLK] [get_bd_pins axi_interconnect_ps/S00_ACLK]
connect_bd_net -net ARESETN_1 [get_bd_pins s_axi_aresetn] [get_bd_pins axi_interconnect_ps/ARESETN] [get_bd_pins axi_interconnect_ps/S00_ARESETN]
connect_bd_net -net M00_ACLK_1 [get_bd_pins m00_axis_aclk] [get_bd_pins axi_interconnect_ps/M00_ACLK] [get_bd_pins channel_00/s_axi_aclk]
connect_bd_net -net M00_ARESETN_1 [get_bd_pins m00_axis_aresetn] [get_bd_pins axi_interconnect_ps/M00_ARESETN] [get_bd_pins channel_00/s_axi_aresetn]
connect_bd_net -net rst_usp_rf_data_converter_256M_peripheral_aresetn [get_bd_pins m10_axis_aresetn] \
  [get_bd_pins axi_interconnect_ps/M01_ARESETN] [get_bd_pins channel_10/s_axi_aresetn]
connect_bd_net -net usp_rf_data_converter_clk_dac1 [get_bd_pins m10_axis_aclk] \
  [get_bd_pins axi_interconnect_ps/M01_ACLK] [get_bd_pins channel_10/s_axi_aclk]

current_bd_instance /radio/transmitter/channel_00
connect_bd_intf_net [get_bd_intf_pins axis_broadcaster/M01_AXIS] [get_bd_intf_pins axis_combiner/S01_AXIS]
connect_bd_intf_net [get_bd_intf_pins m_axis] [get_bd_intf_pins axis_combiner/M_AXIS]
connect_bd_intf_net [get_bd_intf_pins S_AXI] [get_bd_intf_pins control/AXI4_Lite]
connect_bd_intf_net [get_bd_intf_pins axis_broadcaster/M00_AXIS] [get_bd_intf_pins axis_combiner/S00_AXIS]
connect_bd_intf_net [get_bd_intf_pins axis_broadcaster/S_AXIS] [get_bd_intf_pins control/AXI4_Stream_Master]
connect_bd_net -net rst_usp_rf_data_converter_256M_peripheral_aresetn [get_bd_pins s_axi_aresetn] \
  [get_bd_pins axis_broadcaster/aresetn] [get_bd_pins axis_combiner/aresetn] [get_bd_pins control/AXI4_Lite_ARESETN] \
  [get_bd_pins control/IPCORE_RESETN]
connect_bd_net -net usp_rf_data_converter_clk_dac1 [get_bd_pins s_axi_aclk] \
  [get_bd_pins axis_broadcaster/aclk] [get_bd_pins axis_combiner/aclk] [get_bd_pins control/AXI4_Lite_ACLK] \
  [get_bd_pins control/IPCORE_CLK]

current_bd_instance /radio/transmitter/channel_10
connect_bd_intf_net [get_bd_intf_pins axis_broadcaster/M00_AXIS] [get_bd_intf_pins axis_combiner/S00_AXIS]
connect_bd_intf_net [get_bd_intf_pins axis_broadcaster/S_AXIS] [get_bd_intf_pins control/AXI4_Stream_Master]
connect_bd_intf_net [get_bd_intf_pins S_AXI] [get_bd_intf_pins control/AXI4_Lite]
connect_bd_intf_net [get_bd_intf_pins axis_broadcaster/M01_AXIS] [get_bd_intf_pins axis_combiner/S01_AXIS]
connect_bd_intf_net [get_bd_intf_pins m_axis] [get_bd_intf_pins axis_combiner/M_AXIS]
connect_bd_net -net rst_usp_rf_data_converter_256M_peripheral_aresetn [get_bd_pins s_axi_aresetn] \
  [get_bd_pins axis_broadcaster/aresetn] [get_bd_pins axis_combiner/aresetn] [get_bd_pins control/AXI4_Lite_ARESETN] \
  [get_bd_pins control/IPCORE_RESETN]
connect_bd_net -net usp_rf_data_converter_clk_dac1 [get_bd_pins s_axi_aclk] \
  [get_bd_pins axis_broadcaster/aclk] [get_bd_pins axis_combiner/aclk] [get_bd_pins control/AXI4_Lite_ACLK] \
  [get_bd_pins control/IPCORE_CLK]

current_bd_instance /
connect_bd_intf_net [get_bd_intf_pins radio/S_AXI] [get_bd_intf_pins zynq_ultra_ps_e/M_AXI_HPM0_LPD]
connect_bd_intf_net [get_bd_intf_pins axi_smc/M00_AXI] [get_bd_intf_pins zynq_ultra_ps_e/S_AXI_HP2_FPD]
connect_bd_intf_net [get_bd_intf_ports vin0_01] [get_bd_intf_pins radio/vin0_01]
connect_bd_intf_net [get_bd_intf_ports dac0_clk] [get_bd_intf_pins radio/dac0_clk]
connect_bd_intf_net [get_bd_intf_ports vout10] [get_bd_intf_pins radio/vout10]
connect_bd_intf_net [get_bd_intf_ports sys_clk] [get_bd_intf_pins clk_wiz_256M/CLK_IN1_D]
connect_bd_intf_net [get_bd_intf_ports adc0_clk] [get_bd_intf_pins radio/adc0_clk]
connect_bd_intf_net [get_bd_intf_ports vout00] [get_bd_intf_pins radio/vout00]
connect_bd_intf_net [get_bd_intf_ports adc2_clk] [get_bd_intf_pins radio/adc2_clk]
connect_bd_intf_net [get_bd_intf_ports dac1_clk] [get_bd_intf_pins radio/dac1_clk]
connect_bd_intf_net [get_bd_intf_ports sysref_in] [get_bd_intf_pins radio/sysref_in]
connect_bd_intf_net [get_bd_intf_pins axi_smc/S00_AXI] [get_bd_intf_pins radio/M_AXI]
connect_bd_intf_net [get_bd_intf_ports vin2_01] [get_bd_intf_pins radio/vin2_01]
connect_bd_net -net clk_wiz_0_locked [get_bd_pins clk_wiz_256M/locked] [get_bd_pins rst_ps8_256M/dcm_locked]
connect_bd_net -net clk_wiz_260M_clk_out1 [get_bd_pins clk_wiz_256M/clk_out1] \
  [get_bd_pins axi_smc/aclk] [get_bd_pins radio/m_axi_aclk] [get_bd_pins rst_ps8_256M/slowest_sync_clk] \
  [get_bd_pins zynq_ultra_ps_e/saxihp2_fpd_aclk]
connect_bd_net [get_bd_pins lmk_reset_low/dout] [get_bd_ports lmk_reset]
connect_bd_net -net rst_ps8_260M_peripheral_aresetn [get_bd_pins rst_ps8_256M/peripheral_aresetn] \
  [get_bd_pins axi_smc/aresetn] [get_bd_pins radio/m_axi_aresetn]
connect_bd_net -net rst_ps8_96M_peripheral_aresetn [get_bd_pins rst_ps8_100M/peripheral_aresetn] [get_bd_pins radio/s_axi_aresetn]
connect_bd_net [get_bd_pins zynq_ultra_ps_e/pl_clk0] \
  [get_bd_pins radio/s_axi_aclk] [get_bd_pins rst_ps8_100M/slowest_sync_clk] [get_bd_pins zynq_ultra_ps_e/maxihpm0_lpd_aclk]
connect_bd_net [get_bd_pins zynq_ultra_ps_e/pl_resetn0] \
  [get_bd_pins radio/ext_reset] [get_bd_pins rst_ps8_100M/ext_reset_in] [get_bd_pins rst_ps8_256M/ext_reset_in]

# ---- address map ----
assign_bd_address -offset 0x00000000 -range 2G -target_address_space [get_bd_addr_spaces radio/receiver/channel_00/spectrum_analyser/AXI4_Master] [get_bd_addr_segs zynq_ultra_ps_e/SAXIGP4/HP2_DDR_LOW]
assign_bd_address -offset 0xFF000000 -range 16M -target_address_space [get_bd_addr_spaces radio/receiver/channel_00/spectrum_analyser/AXI4_Master] [get_bd_addr_segs zynq_ultra_ps_e/SAXIGP4/HP2_LPS_OCM]
assign_bd_address -offset 0x00000000 -range 2G -target_address_space [get_bd_addr_spaces radio/receiver/channel_20/spectrum_analyser/AXI4_Master] [get_bd_addr_segs zynq_ultra_ps_e/SAXIGP4/HP2_DDR_LOW]
assign_bd_address -offset 0xFF000000 -range 16M -target_address_space [get_bd_addr_spaces radio/receiver/channel_20/spectrum_analyser/AXI4_Master] [get_bd_addr_segs zynq_ultra_ps_e/SAXIGP4/HP2_LPS_OCM]
assign_bd_address -offset 0x0080000000 -range 256K -target_address_space [get_bd_addr_spaces zynq_ultra_ps_e/Data] [get_bd_addr_segs radio/rfdc/s_axi/Reg]
assign_bd_address -offset 0x0080040000 -range 64K -target_address_space [get_bd_addr_spaces zynq_ultra_ps_e/Data] [get_bd_addr_segs radio/receiver/channel_00/decimator/xsg_bwselector_s_axi/reg0]
assign_bd_address -offset 0x0080050000 -range 64K -target_address_space [get_bd_addr_spaces zynq_ultra_ps_e/Data] [get_bd_addr_segs radio/receiver/channel_00/spectrum_analyser/AXI4_Lite/reg0]
assign_bd_address -offset 0x0080060000 -range 64K -target_address_space [get_bd_addr_spaces zynq_ultra_ps_e/Data] [get_bd_addr_segs radio/receiver/channel_20/spectrum_analyser/AXI4_Lite/reg0]
assign_bd_address -offset 0x0080070000 -range 64K -target_address_space [get_bd_addr_spaces zynq_ultra_ps_e/Data] [get_bd_addr_segs radio/receiver/channel_20/decimator/xsg_bwselector_s_axi/reg0]
assign_bd_address -offset 0x0080080000 -range 64K -target_address_space [get_bd_addr_spaces zynq_ultra_ps_e/Data] [get_bd_addr_segs radio/transmitter/channel_10/control/AXI4_Lite/reg0]
assign_bd_address -offset 0x0080090000 -range 64K -target_address_space [get_bd_addr_spaces zynq_ultra_ps_e/Data] [get_bd_addr_segs radio/transmitter/channel_00/control/AXI4_Lite/reg0]

validate_bd_design
save_bd_design
